# Altium schematic sheet USB_Protection.SchDoc: Наименование
size 209 x 297 mm; ApprovedBy: Утвердил; CheckedBy: Проверил; Author: Разработал; CompanyName: Организация; DrawnBy: Н.Контр; Engineer: Т.Контр; SheetNumber: 1; SheetTotal: 6; PageSetup: Record=PageOptions|CenterHorizontal=True|CenterVertical=True|PrintScale=0.94|XCorrection=1.00|YCorrection=1.00|PrintKind=1|BorderSize=5000000|LeftOffset=0|BottomOffset=0|Orientation=1|PaperLength=1000|PaperWidth=1000|Scale=100|PaperSource=7|PrintQuality=-4|MediaType=1|DitherType=10|PaperKind=A4|PrintScaleMode=1; DecimalNumber: Децимальный номер; HeadOfSector: Нач. сектора; MainDevice: Перв.примен.; Name: Наименование; DocumentName: Sheet1.SCHDOC
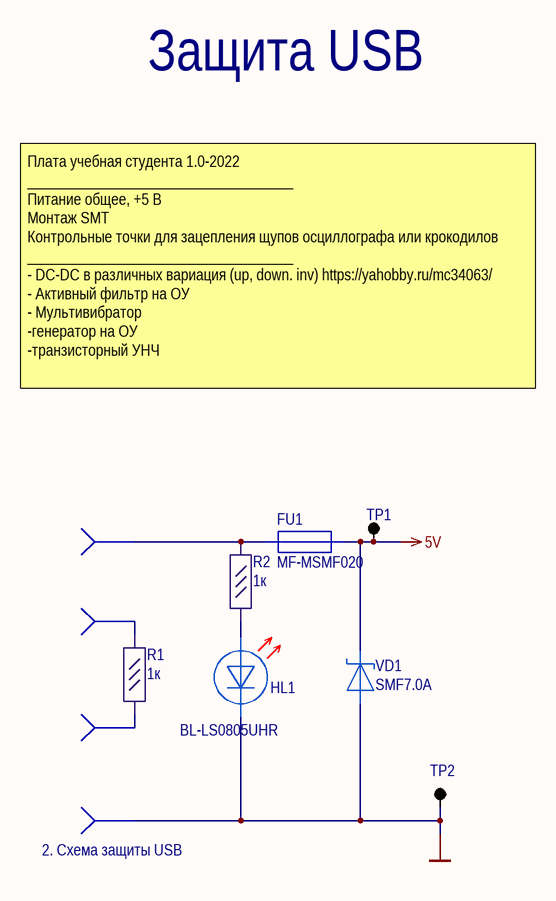
[diagram p0: USB_Protection.SchDoc]

## Parts
FU1  MF-MSMF020  [FUSE 1812]
HL1  BL-LS0805UHR  [LED_0805_RED]
R1  1к  [R_0805]
R2  1к  [R_0805]
TP1  Test_Point_1  [PLS-1]  (value not drawn)
TP2  Test_Point_1  [PLS-1]  (value not drawn)
VD1  SMF7.0A  [SOD-123F]
X1  X  [KT_1]  (value not drawn)
X2  X  [KT_1]  (value not drawn)
X3  X  [KT_1]  (value not drawn)
X4  X  [KT_1]  (value not drawn)

## Nets
5V: FU1.2 TP1.1 VD1.2
GND: HL1.2 TP2.1 VD1.1 X4.1
NetFU1_1: FU1.1 R2.1 X1.1
NetHL1_1: HL1.1 R2.2
NetR1_1: R1.1 X2.1
NetR1_2: R1.2 X3.1

## Notes on the sheet
- Защита USB
- Плата учебная студента 1.0-2022
  ___________________________________
  Питание общее, +5 В
  Монтаж SMT
  Контрольные точки для зацепления щупов осциллографа или крокодилов
  ___________________________________
  - DC-DC в различных вариация (up, down. inv) https://yahobby.ru/mc34063/
  - Активный фильтр на ОУ
  - Мультивибратор
  -генератор на ОУ
  -транзисторный УНЧ
- (near X4) 2. Схема защиты USB
- Перв.примен.
- Справ.№
- Подп. и дата
- Инв.№ дубл.
- Взам.инв.№
- Подп.и дата
- Разраб.
- Изм.
- Лист
- № докум.
- Подп.
- Дата
- Лит.
- Масштаб
- Масса
- Т.контр.
- Пров.
- ПРИНЦИПИАЛЬНАЯ
- СХЕМА   ЭЛЕКТРИЧЕСКАЯ
- Листов
- Инв.№ подл.
- Утв.
- Н.контр.
- Нач.сект.
- Копировал
- Формат  A3

## Library data of the parts
R1 R2 = CR0603-FX-1002ELF: RES SMD 10K OHM 1% 1/10W 0603; Manufacturer: Bourns Inc.; Value: 10 к; Part Number: CR0603-FX-1002ELF; ComponentLink1URL: https://www.bourns.com/pdfs/chpreztr.pdf; ComponentLink1Description: Datasheet; Component Type: Resistor
VD1 = SMAJ5.0A-TR: Защитный диод, однонаправленный
X1-X4 = X: Контактная площадка